# Altium schematic sheet PSU2.SchDoc: PSU2
size A3; Date: JUN 2020; ApprovedBy: Hören; CheckedBy: Mörz; Author: Rudziński; CompanyName: Semi-ATE; DrawnBy: Rudziński; Engineer: Hören; Organization: Semi-ATE; DocumentNumber: 15; SheetNumber: 15; SheetTotal: 20
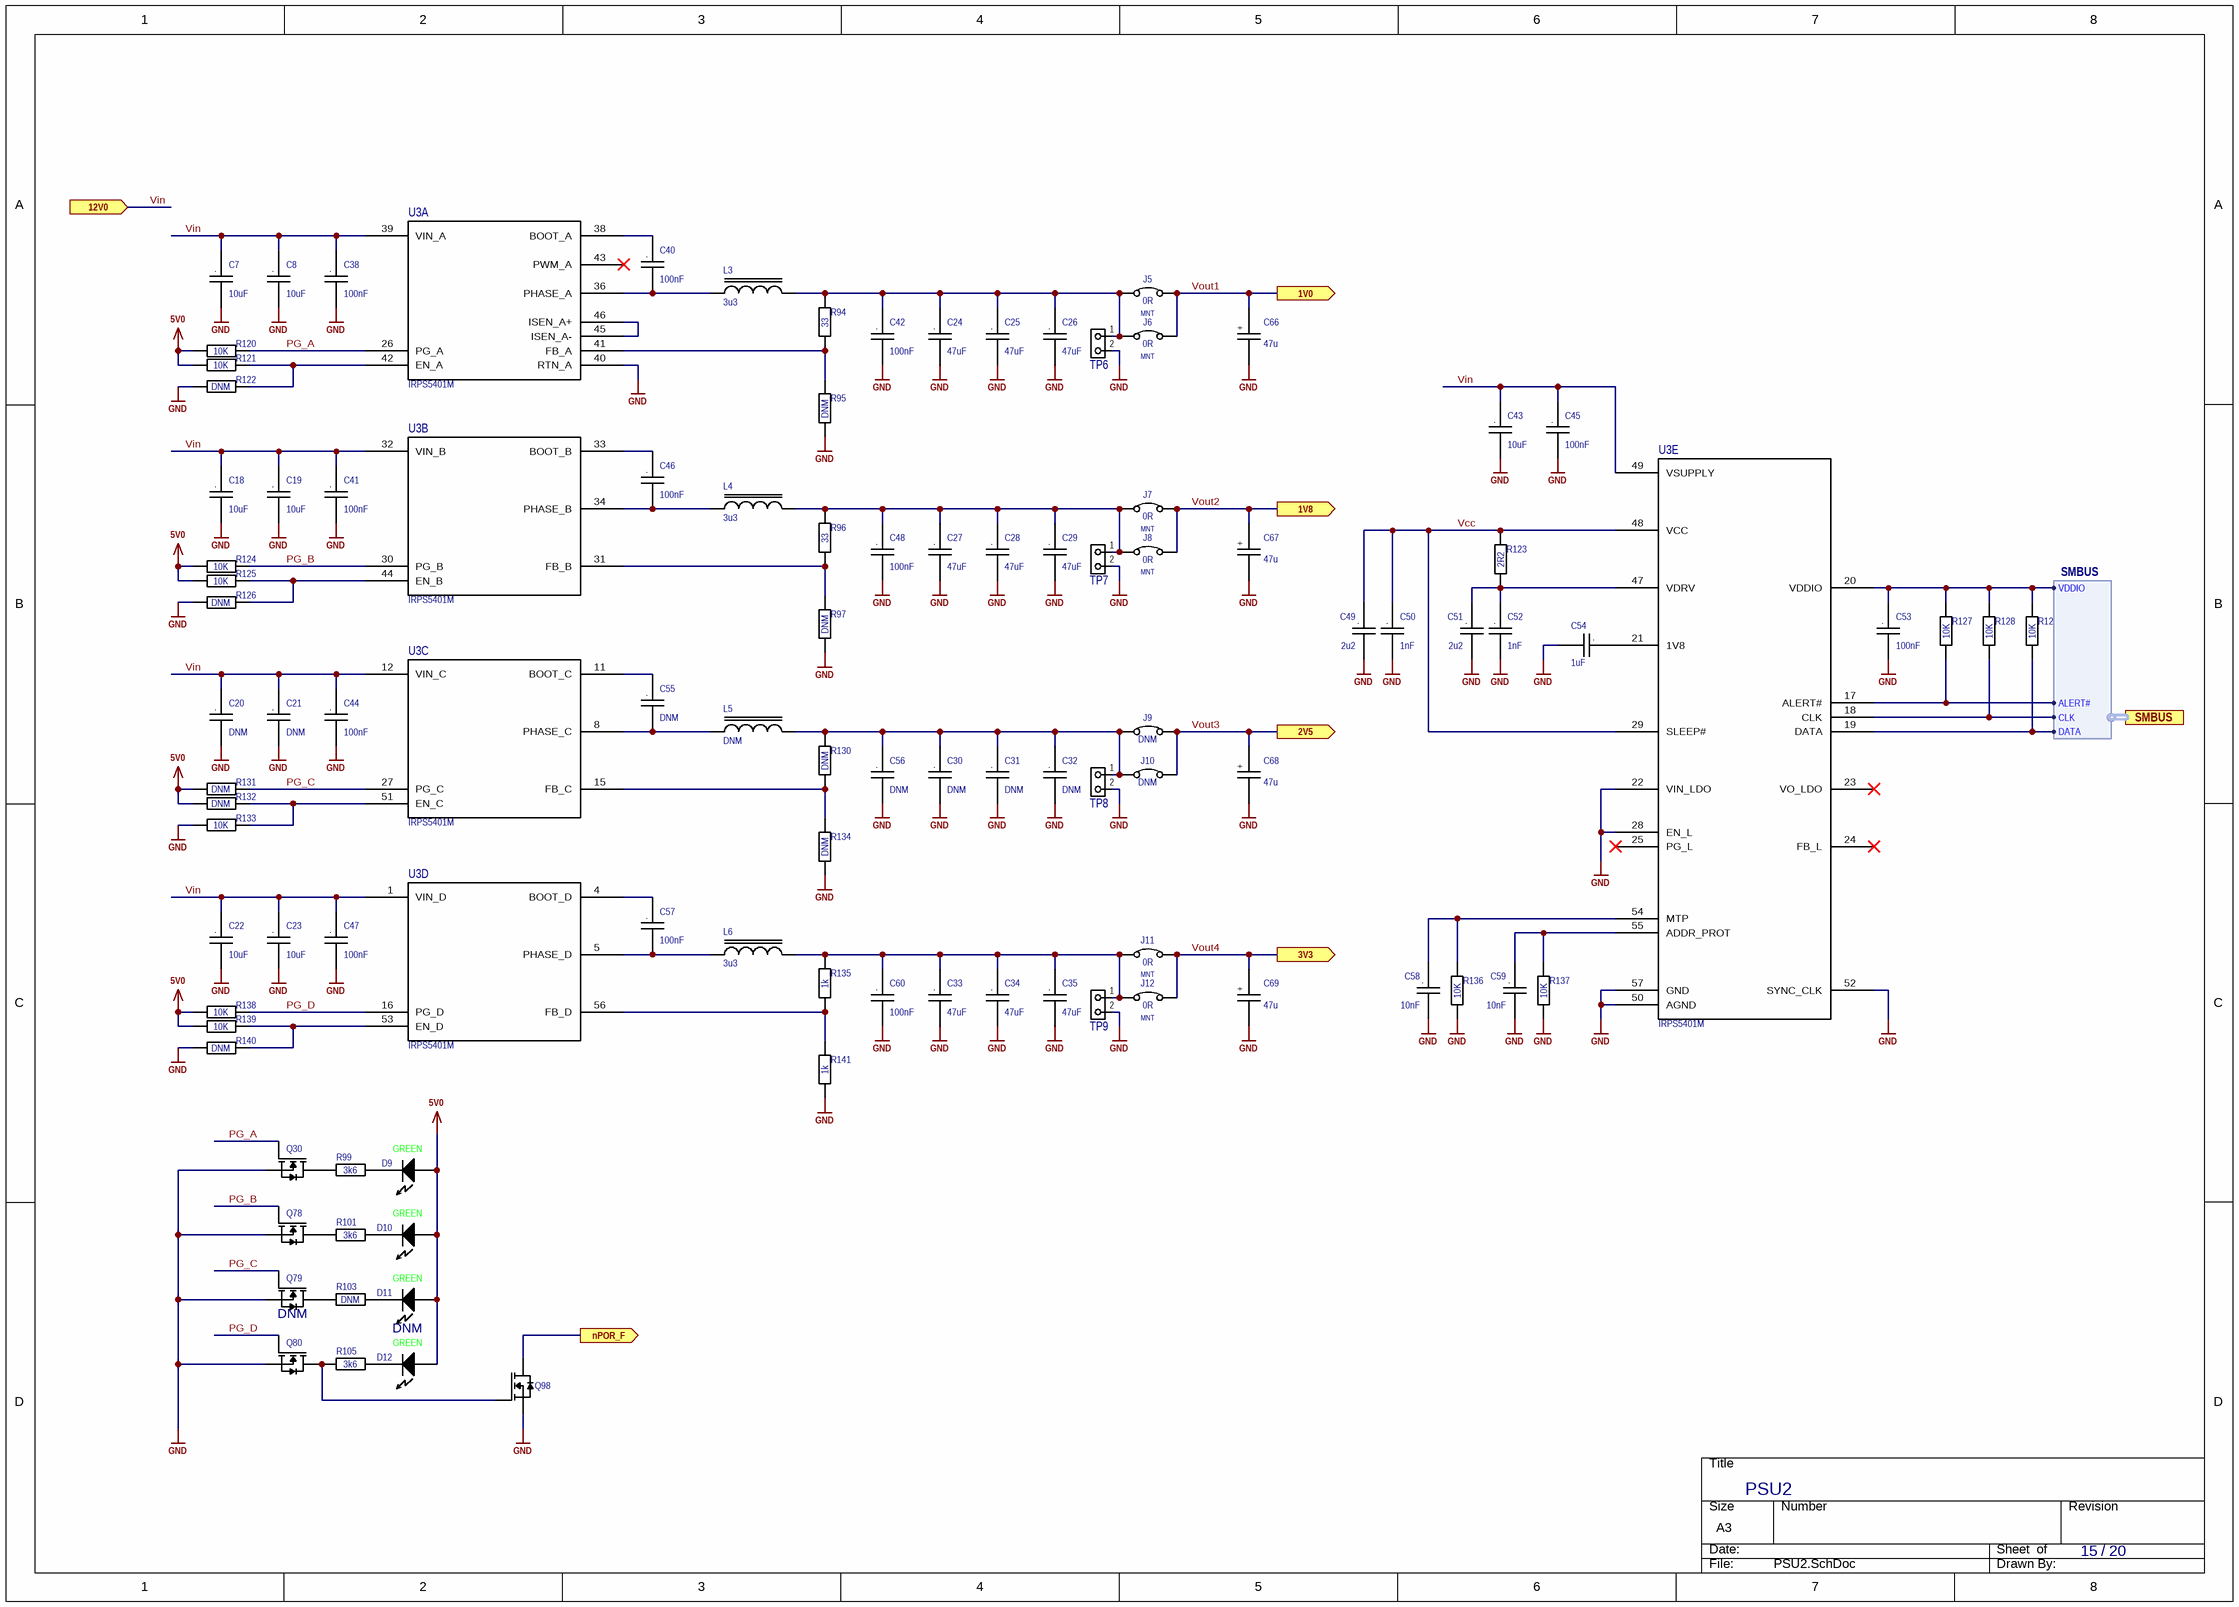
[diagram p0: PSU2.SchDoc]

## Parts
C7  value 10uF  [C1206 Reflow]  (hidden comment: C)
C8  value 10uF  [C1206 Reflow]  (hidden comment: C)
C18  value 10uF  [C1206 Reflow]  (hidden comment: C)
C19  value 10uF  [C1206 Reflow]  (hidden comment: C)
C20  value DNM  [C1206 Reflow]  (hidden comment: C)  (no BOM)
C21  value DNM  [C1206 Reflow]  (hidden comment: C)  (no BOM)
C22  value 10uF  [C1206 Reflow]  (hidden comment: C)
C23  value 10uF  [C1206 Reflow]  (hidden comment: C)
C24  value 47uF  [C1210 Reflow]  (hidden comment: C)
C25  value 47uF  [C1210 Reflow]  (hidden comment: C)
C26  value 47uF  [C1210 Reflow]  (hidden comment: C)
C27  value 47uF  [C1210 Reflow]  (hidden comment: C)
C28  value 47uF  [C1210 Reflow]  (hidden comment: C)
C29  value 47uF  [C1210 Reflow]  (hidden comment: C)
C30  value DNM  [C1210 Reflow]  (hidden comment: C)  (no BOM)
C31  value DNM  [C1210 Reflow]  (hidden comment: C)  (no BOM)
C32  value DNM  [C1210 Reflow]  (hidden comment: C)  (no BOM)
C33  value 47uF  [C1210 Reflow]  (hidden comment: C)
C34  value 47uF  [C1210 Reflow]  (hidden comment: C)
C35  value 47uF  [C1210 Reflow]  (hidden comment: C)
C38  value 100nF  [C0402 Reflow]  (hidden comment: C)
C40  value 100nF  [C0402 Reflow]  (hidden comment: C)
C41  value 100nF  [C0402 Reflow]  (hidden comment: C)
C42  value 100nF  [C0402 Reflow]  (hidden comment: C)
C43  value 10uF  [C1206 Reflow]  (hidden comment: C)
C44  value 100nF  [C0402 Reflow]  (hidden comment: C)
C45  value 100nF  [C0402 Reflow]  (hidden comment: C)
C46  value 100nF  [C0402 Reflow]  (hidden comment: C)
C47  value 100nF  [C0402 Reflow]  (hidden comment: C)
C48  value 100nF  [C0402 Reflow]  (hidden comment: C)
C49  value 2u2  [C0805 Reflow]  (hidden comment: C)
C50  value 1nF  [C0402 Reflow]  (hidden comment: C)
C51  value 2u2  [C0805 Reflow]  (hidden comment: C)
C52  value 1nF  [C0402 Reflow]  (hidden comment: C)
C53  value 100nF  [C0402 Reflow]  (hidden comment: C)
C54  value 1uF  [C0402 Reflow]  (hidden comment: C)
C55  value DNM  [C0402 Reflow]  (hidden comment: C)  (no BOM)
C56  value DNM  [C0402 Reflow]  (hidden comment: C)  (no BOM)
C57  value 100nF  [C0402 Reflow]  (hidden comment: C)
C58  value 10nF  [C0402 Reflow]  (hidden comment: C)
C59  value 10nF  [C0402 Reflow]  (hidden comment: C)
C60  value 100nF  [C0402 Reflow]  (hidden comment: C)
C66  value 47u  [CAP_TAN_B]  (hidden comment: C+)
C67  value 47u  [CAP_TAN_B]  (hidden comment: C+)
C68  value 47u  [CAP_TAN_B]  (hidden comment: C+)
C69  value 47u  [CAP_TAN_B]  (hidden comment: C+)
D9  Color: GREEN  [L0603G]  (hidden comment: D)
D10  Color: GREEN  [L0603G]  (hidden comment: D)
D11  Color: GREEN  NicName: DNM  [L0603G]  (hidden comment: D)  (no BOM)
D12  Color: GREEN  [L0603G]  (hidden comment: D)
J5  value 0R  POPULATED: MNT  [JumperSMD]  (hidden comment: J)  (no BOM)
J6  value 0R  POPULATED: MNT  [JumperSMD]  (hidden comment: J)  (no BOM)
J7  value 0R  POPULATED: MNT  [JumperSMD]  (hidden comment: J)  (no BOM)
J8  value 0R  POPULATED: MNT  [JumperSMD]  (hidden comment: J)  (no BOM)
J9  value DNM  [JumperSMD]  (hidden comment: J)  (no BOM)
J10  value DNM  [JumperSMD]  (hidden comment: J)  (no BOM)
J11  value 0R  POPULATED: MNT  [JumperSMD]  (hidden comment: J)  (no BOM)
J12  value 0R  POPULATED: MNT  [JumperSMD]  (hidden comment: J)  (no BOM)
L3  Inductance: 3u3  [XAL7070]  (hidden comment: L)
L4  Inductance: 3u3  [XAL7070]  (hidden comment: L)
L5  Inductance: DNM  [XAL7070]  (hidden comment: L)  (no BOM)
L6  Inductance: 3u3  [XAL7070]  (hidden comment: L)
Q30  Q  [SOT23-3]  (value not drawn)
Q78  Q  [SOT23-3]  (value not drawn)
Q79  NicName: DNM  [SOT23-3]  (hidden comment: Q)  (no BOM)
Q80  Q  [SOT23-3]  (value not drawn)
Q98  Q  [SOT23-3]  (value not drawn)
R94  value 33  [R0402 Reflow]  (hidden comment: R)
R95  value DNM  [R0402 Reflow]  (hidden comment: R)  (no BOM)
R96  value 33  [R0402 Reflow]  (hidden comment: R)
R97  value DNM  [R0402 Reflow]  (hidden comment: R)  (no BOM)
R99  value 3k6  [R0603 Reflow]  (hidden comment: R)
R101  value 3k6  [R0603 Reflow]  (hidden comment: R)
R103  value DNM  [R0603 Reflow]  (hidden comment: R)  (no BOM)
R105  value 3k6  [R0603 Reflow]  (hidden comment: R)
R120  value 10K  [R0402 Reflow]  (hidden comment: R)
R121  value 10K  [R0402 Reflow]  (hidden comment: R)
R122  value DNM  [R0402 Reflow]  (hidden comment: R)  (no BOM)
R123  value 2R2  [R0402 Reflow]  (hidden comment: R)
R124  value 10K  [R0402 Reflow]  (hidden comment: R)
R125  value 10K  [R0402 Reflow]  (hidden comment: R)
R126  value DNM  [R0402 Reflow]  (hidden comment: R)  (no BOM)
R127  value 10K  [R0402 Reflow]  (hidden comment: R)
R128  value 10K  [R0402 Reflow]  (hidden comment: R)
R129  value 10K  [R0402 Reflow]  (hidden comment: R)
R130  value DNM  [R0402 Reflow]  (hidden comment: R)  (no BOM)
R131  value DNM  [R0402 Reflow]  (hidden comment: R)  (no BOM)
R132  value DNM  [R0402 Reflow]  (hidden comment: R)  (no BOM)
R133  value 10K  [R0402 Reflow]  (hidden comment: R)
R134  value DNM  [R0402 Reflow]  (hidden comment: R)  (no BOM)
R135  value 1k  [R0402 Reflow]  (hidden comment: R)
R136  value 10K  [R0402 Reflow]  (hidden comment: R)
R137  value 10K  [R0402 Reflow]  (hidden comment: R)
R138  value 10K  [R0402 Reflow]  (hidden comment: R)
R139  value 10K  [R0402 Reflow]  (hidden comment: R)
R140  value DNM  [R0402 Reflow]  (hidden comment: R)  (no BOM)
R141  value 1k  [R0402 Reflow]  (hidden comment: R)
TP6  TP  [DualTestpoint 100mils]  (value not drawn)  (no BOM)
TP7  TP  [DualTestpoint 100mils]  (value not drawn)  (no BOM)
TP8  TP  [DualTestpoint 100mils]  (value not drawn)  (no BOM)
TP9  TP  [DualTestpoint 100mils]  (value not drawn)  (no BOM)
U3  U  [QFN4-7x7-56_IRPS5401M]  (value not drawn)  (parts A,B,C,D,E of 5)

## Ports
1V0 (out), 1V8 (out), 2V5 (out), 3V3 (out), 12V0 (in), nPOR_F (out), SMBUS (harness SMBUS)

## Harnesses
SMBUS: ALERT#, CLK, DATA, VDDIO

## Nets
5V0: D9.1(Anode) D10.1(Anode) D11.1(Anode) D12.1(Anode) R120.2 R121.2 R124.2 R125.2 R131.2 R132.2 R138.2 R139.2
GND: C7.2 C8.2 C18.2 C19.2 C20.2 C21.2 C22.2 C23.2 C24.2 C25.2 C26.2 C27.2 C28.2 C29.2 C30.2 C31.2 C32.2 C33.2 C34.2 C35.2 C38.2 C41.2 C42.2 C43.2 C44.2 C45.2 C47.2 C48.2 C49.2 C50.2 C51.2 C52.2 C53.2 C54.2 C56.2 C58.2 C59.2 C60.2 C66.2 C67.2 C68.2 C69.2 Q30.2(S) Q78.2(S) Q79.2(S) Q80.2(S) Q98.2(S) R95.1 R97.1 R122.2 R126.2 R133.2 R134.1 R136.1 R137.1 R140.2 R141.1 TP6.2 TP7.2 TP8.2 TP9.2 U3.22(VIN_LDO) U3.28(EN_L) U3.40(RTN_A) U3.50(AGND) U3.52(SYNC_CLK) U3.57(GND)
nPOR_F: Q98.3(D) ; port nPOR_F
PG_A: Q30.1(G) R120.1 U3.26(PG_A)
PG_B: Q78.1(G) R124.1 U3.30(PG_B)
PG_C: Q79.1(G) R131.1 U3.27(PG_C)
PG_D: Q80.1(G) R138.1 U3.16(PG_D)
Vcc: C49.1 C50.1 R123.2 U3.29(SLEEP#) U3.48(VCC)
Vin: C7.1 C8.1 C18.1 C19.1 C20.1 C21.1 C22.1 C23.1 C38.1 C41.1 C43.1 C44.1 C45.1 C47.1 U3.1(VIN_D) U3.12(VIN_C) U3.32(VIN_B) U3.39(VIN_A) U3.49(VSUPPLY) ; port 12V0
Vout1: C66.1 J5.2 J6.2 ; port 1V0
Vout2: C67.1 J7.2 J8.2 ; port 1V8
Vout3: C68.1 J9.2 J10.2 ; port 2V5
Vout4: C69.1 J11.2 J12.2 ; port 3V3
NetC24_1: C24.1 C25.1 C26.1 C42.1 J5.1 J6.1 L3.2 R94.2 TP6.1
NetC27_1: C27.1 C28.1 C29.1 C48.1 J7.1 J8.1 L4.2 R96.2 TP7.1
NetC30_1: C30.1 C31.1 C32.1 C56.1 J9.1 J10.1 L5.2 R130.2 TP8.1
NetC33_1: C33.1 C34.1 C35.1 C60.1 J11.1 J12.1 L6.2 R135.2 TP9.1
NetC40_1: C40.1 U3.38(BOOT_A)
NetC40_2: C40.2 L3.1 U3.36(PHASE_A)
NetC46_1: C46.1 U3.33(BOOT_B)
NetC46_2: C46.2 L4.1 U3.34(PHASE_B)
NetC51_1: C51.1 C52.1 R123.1 U3.47(VDRV)
NetC53_1: C53.1 R127.2 R128.2 R129.2 U3.20(VDDIO) ; port SMBUS.VDDIO
NetC54_1: C54.1 U3.21(1V8)
NetC55_1: C55.1 U3.11(BOOT_C)
NetC55_2: C55.2 L5.1 U3.8(PHASE_C)
NetC57_1: C57.1 U3.4(BOOT_D)
NetC57_2: C57.2 L6.1 U3.5(PHASE_D)
NetC58_1: C58.1 R136.2 U3.54(MTP)
NetC59_1: C59.1 R137.2 U3.55(ADDR_PROT)
NetD9_2: D9.2(Cathode) R99.2
NetD10_2: D10.2(Cathode) R101.2
NetD11_2: D11.2(Cathode) R103.2
NetD12_2: D12.2(Cathode) R105.2
NetQ30_3: Q30.3(D) R99.1
NetQ78_3: Q78.3(D) R101.1
NetQ79_3: Q79.3(D) R103.1
NetQ80_3: Q80.3(D) Q98.1(G) R105.1
NetR94_1: R94.1 R95.2 U3.41(FB_A)
NetR96_1: R96.1 R97.2 U3.31(FB_B)
NetR121_1: R121.1 R122.1 U3.42(EN_A)
NetR125_1: R125.1 R126.1 U3.44(EN_B)
NetR127_1: R127.1 U3.17(ALERT#) ; port SMBUS.ALERT#
NetR128_1: R128.1 U3.18(CLK) ; port SMBUS.CLK
NetR129_1: R129.1 U3.19(DATA) ; port SMBUS.DATA
NetR130_1: R130.1 R134.2 U3.15(FB_C)
NetR132_1: R132.1 R133.1 U3.51(EN_C)
NetR135_1: R135.1 R141.2 U3.56(FB_D)
NetR139_1: R139.1 R140.1 U3.53(EN_D)
NetU3_45: U3.45(ISEN_A-) U3.46(ISEN_A+)

Not connected (* = marked no-connect by the designer): U3 23(VO_LDO)* 24(FB_L)* 25(PG_L)* 43(PWM_A)*

## Notes on the sheet
- /
- designed by
- reviewed by
- last drawn by
- Project:
- Schematic:
- last printed
- DIN-A3 L
- sheets
- of
- File:
- (in symbol C) .
- (in symbol C+_TAN) +
- (in symbol C_2) .
- (in symbol C_7) .
- (in symbol C_10) .
- (in symbol C_11) .

## Library data of the parts
C7 C8 C18-C23 C43 = C: CAP CER 10UF 25V X7R 1206; 04. Manufacturer: TDK Corporation; 07. Manufacturer  Part Number: C3216X7R1E106K160AB; Tolerance: ±10%; 03. Unit Price: 0.66; 13. Created Date/Name: AUG2018/Hören; Voltage Rating: 25V; Type: X7R; ComponentLink1Description: Info; ComponentLink1URL: https://www.digikey.de/products/en?keywords=445-7705-6-ND; 02. Distributor Part Number: 445-7705-6-ND; 09. Operating Temperature: -55°C ~ 125°C; 11. RoHS: YES; 01. Distributor: DigiKey; ComponentLink2Description: DataSheet; Package: 1206
C24-C35 = C: CAP CER 47UF 10V X5R 1210; 04. Manufacturer: Samsung Electro-Mechanics; 07. Manufacturer  Part Number: CL32A476MPJNNNE; Tolerance: ±20%; 03. Unit Price: 0.88; 13. Created Date/Name: AUG2018/Hören; Voltage Rating: 10V; Type: X5R; ComponentLink1Description: Info; ComponentLink1URL: *; 02. Distributor Part Number: 1276-3380-6-ND; 09. Operating Temperature: -55°C ~ 85°C; 11. RoHS: YES; 01. Distributor: DigiKey; ComponentLink2Description: DataSheet; Package: 1210
C38 C40-C42 C44-C48 C53 C55-C57 C60 = C: CAP CER 0.1UF 25V X7R 0402; 04. Manufacturer: Yageo; 07. Manufacturer  Part Number: CC0402KRX7R8BB104; Tolerance: ±10%; 03. Unit Price: 0.09; 13. Created Date/Name: AUG2018/Hören; Voltage Rating: 25V; Type: X7R; ComponentLink1Description: Info; ComponentLink1URL: https://www.digikey.de/products/en?keywords=311-2077-6-ND; 02. Distributor Part Number: 311-2077-6-ND; 09. Operating Temperature: -55°C ~ 125°C; 11. RoHS: YES; 01. Distributor: DigiKey; ComponentLink2Description: DataSheet; Package: 0402
C49 C51 = C_11: CAP CER 2.2UF 10V X7R 0805; 04. Manufacturer: Samsung Electro-Mechanics; 07. Manufacturer  Part Number: CL21B225KPFNNNE; 03. Unit Price: 0.11; Voltage Rating: 10V; Type: X7R; ComponentLink1Description: Info; ComponentLink1URL: https://www.digikey.de/products/en?keywords=311-2077-6-ND; 02. Distributor Part Number: 1276-1188-1-ND; 11. RoHS: YES; 01. Distributor: DigiKey; ComponentLink2Description: DataSheet; Package: 0805
C50 C52 = C_7: CAP CER 1000PF 25V X7R 0402; 04. Manufacturer: KEMET; 07. Manufacturer  Part Number: C0402C102K3RACTU; Tolerance: ±10%; 03. Unit Price: 0.09; 13. Created Date/Name: AUG2018/Hören; Voltage Rating: 25V; Type: X7R; ComponentLink1Description: Info; ComponentLink1URL: https://www.digikey.de/products/en?keywords=399-1031-6-ND; 02. Distributor Part Number: 399-1031-6-ND; 09. Operating Temperature: -55°C ~ 125°C; 11. RoHS: YES; 01. Distributor: DigiKey; ComponentLink2Description: DataSheet; Package: 0402
C54 = C_2: CAP CER 1UF 6.3V X7R 0402; 04. Manufacturer: Murata Electronics; 07. Manufacturer  Part Number: GRM155R70J105KA12J; Tolerance: ±10%; 03. Unit Price: 0.11; 13. Created Date/Name: AUG2018/Hören; Voltage Rating: 6.3V; Type: X7R; ComponentLink1Description: Info; ComponentLink1URL: https://www.digikey.de/product-detail/en/murata-electronics/GRM155R70J105KA12J/490-13339-6-ND/5973468; 02. Distributor Part Number: 490-13339-6-ND; 09. Operating Temperature: -55°C ~ 125°C; 11. RoHS: YES; 01. Distributor: DigiKey; ComponentLink2Description: DataSheet; Package: 0402
C58 C59 = C_10: CAP CER 0.01UF 25V X7R 0402; 04. Manufacturer: Murata Electronics; 07. Manufacturer  Part Number: GCM155R71E103KA37D; Tolerance: ±10%; 03. Unit Price: 0.09; Voltage Rating: 25V; Type: X7R; ComponentLink1Description: Info; 02. Distributor Part Number: 490-6043-1-ND; 09. Operating Temperature: -55°C ~ 125°C; 11. RoHS: YES; 01. Distributor: DigiKey; ComponentLink2Description: DataSheet; ComponentLink2URL: https://www.murata.com/~/media/webrenewal/support/library/catalog/products/capacitor/mlcc/c03e.ashx?la=en-us; Package: 0402
  C58: ComponentLink1URL: https://www.digikey.de/products/en?keywords=311-2077-6-ND
  C59: ComponentLink1URL: https://www.digikey.de/product-detail/en/murata-electronics/GCM155R71E103KA37D/490-6043-1-ND/3845243
C66-C69 = C+_TAN: CAP TANT 47UF 20% 10V 1411; 04. Manufacturer: AVX Corporation; 07. Manufacturer  Part Number: F971A476MBAHT3; 03. Unit Price: 0.73; 3D-Export: No; ComponentLink1Description: Info; 02. Distributor Part Number: 478-12531-1-ND; 11. RoHS: YES; 01. Distributor: DigiKey; ComponentLink2Description: DataSheet
D9-D12 = LED: LED GREEN DIFFUSED 0603 SMD; 04. Manufacturer: OSRAM Opto Semiconductors Inc.; 07. Manufacturer  Part Number: LG L29K-G2J1-24-Z; Vf: 1.7V; If: 2mA; Wave Length: 570nm; Viewing Angle: 160°; 03. Unit Price: 0.4; 13. Created Date/Name: AUG2018/Hören; ComponentLink1Description: Info; ComponentLink1URL: https://www.digikey.de/products/en?keywords=475-2709-6-ND; ComponentLink2Description: DataSheet; ComponentLink2URL: https://www.digikey.de/products/en?keywords=475-2709-6-ND; 02. Distributor Part Number: 475-2709-6-ND; 11. RoHS: YES; 01. Distributor: DigiKey
J5-J12 = Jumper SMD: RES SMD 0 OHM JUMPER 1/10W 0603; 04. Manufacturer: Yageo; 07. Manufacturer  Part Number: RC0603JR-070RL; 03. Unit Price: 0.09; 01. Distributor: DigiKey; 02. Distributor Part Number: 311-0.0GRDKR-ND; 09. Operating Temperature: -55°C ~ 155°C; 11. RoHS: YES; Package: 0603; ComponentLink4Description: Info; ComponentLink4URL: https://www.digikey.de/product-detail/en/yageo/RC0603JR-070RL/311-0.0GRDKR-ND/732569; ComponentLink5Description: DataSheet; ComponentLink5URL: http://www.yageo.com/documents/recent/PYu-RC_Group_51_RoHS_L_10.pdf
L3-L6 = INDUCTOR: Fixed Inductors 3.3uH Shld 20% 15.1A 9.42mOhms AECQ2; 04. Manufacturer: Coilcraft; 07. Manufacturer  Part Number: XAL7070-332MEC; Impedance Tolerance: %; 03. Unit Price: 3.05; ComponentLink1Description: Info; ComponentLink1URL: https://www.digikey.de/products/en?keywords=732-1620-6-ND; ComponentLink2Description: DataSheet; ComponentLink2URL: https://www.we-online.de/katalog/datasheet/742792040.pdf; 02. Distributor Part Number: 994-XAL7070-332MEC; 11. RoHS: YES; Tolerance: *; Value: *; 01. Distributor: Mouser
Q30 Q78-Q80 Q98 = FDV303N: MOSFET N-CH 25V 680MA SOT-23; 04. Manufacturer: ON Semiconductor; 03. Unit Price: 0.41; 13. Created Date/Name: AUG 2018 / Hören; Rds On: 450 mΩ @ id=500mA & Vgs=4.5V; Vgs,th: 1.5V @ 250uA; Power Rating: 350mW; 3D-Export: No; 01. Distributor: DigiKey; 02. Distributor Part Number: FDV303NDKR-ND; 07. Manufacturer  Part Number: FDV303N; 09. Operating Temperature: -55°C ~ 150°C (TJ); 11. RoHS: YES; ComponentLink1Description: Info; ComponentLink1URL: https://www.digikey.de/product-detail/en/on-semiconductor/FDV303N/FDV303NDKR-ND/1630434; ComponentLink2Description: DataSheet; ComponentLink2URL: https://media.digikey.com/pdf/Data%20Sheets/Fairchild%20PDFs/FDV303N.pdf; Vdss: 25V; Id: 680mA
R94 R96 = R: RES SMD 33 OHM 1% 1/16W 0402; 04. Manufacturer: Yageo; 07. Manufacturer  Part Number: RC0402FR-0733RL; 03. Unit Price: 0.09; 13. Created Date/Name: AUG2018/Hören; Power Rating: 63mW; Tolerance: ±1%; ComponentLink1URL: https://www.digikey.de/products/en?keywords=311-10.0KLRDKR-ND; ComponentLink1Description: Info; 02. Distributor Part Number: 311-33.0LRDKR-ND; 09. Operating Temperature: -55°C ~ 155°C; 11. RoHS: YES; 01. Distributor: DigiKey; ComponentLink2Description: DataSheet; Type: Thick Film; Package: 0402
R95 R97 R120-R122 R124-R134 R136-R140 = R: RES SMD 10K OHM 1% 1/16W 0402; 04. Manufacturer: Yageo; 07. Manufacturer  Part Number: RC0402FR-0710KL; 03. Unit Price: 0.09; 13. Created Date/Name: AUG2018/Hören; Power Rating: 63mW; Tolerance: ±1%; ComponentLink1URL: https://www.digikey.de/products/en?keywords=311-10.0KLRDKR-ND; ComponentLink1Description: Info; 02. Distributor Part Number: 311-10.0KLRDKR-ND; 09. Operating Temperature: -55°C ~ 155°C; 11. RoHS: YES; 01. Distributor: DigiKey; ComponentLink2Description: DataSheet; Type: Thick Film; Package: 0402
R99 R101 R105 = R: RES SMD 3.6K OHM 1% 1/10W 0603; 04. Manufacturer: Yageo; 07. Manufacturer  Part Number: RC0603FR-073K6L; 03. Unit Price: 0.09; 13. Created Date/Name: AUG2018/Hören; Power Rating: 63mW; Tolerance: ±1%; ComponentLink1URL: https://www.digikey.de/product-detail/en/yageo/RC0402FR-071K65L/YAG3043DKR-ND/5282914; ComponentLink1Description: Info; 02. Distributor Part Number: 311-3.60KHRCT-ND; 09. Operating Temperature: -55°C ~ 155°C; 11. RoHS: YES; 01. Distributor: DigiKey; ComponentLink2Description: DataSheet; Type: Thick Film; Package: 0402
R103 = R: RES SMD 1.65K OHM 1% 1/16W 0402; 04. Manufacturer: Yageo; 07. Manufacturer  Part Number: RC0402FR-071K65L; 03. Unit Price: 0.09; 13. Created Date/Name: AUG2018/Hören; Power Rating: 63mW; Tolerance: ±1%; ComponentLink1URL: https://www.digikey.de/product-detail/en/yageo/RC0402FR-071K65L/YAG3043DKR-ND/5282914; ComponentLink1Description: Info; 02. Distributor Part Number: YAG3043DKR-ND; 09. Operating Temperature: -55°C ~ 155°C; 11. RoHS: YES; 01. Distributor: DigiKey; ComponentLink2Description: DataSheet; Type: Thick Film; Package: 0402
R123 = R_24: RES SMD 2.2 OHM 1% 1/16W 0402; 04. Manufacturer: Yageo; 07. Manufacturer  Part Number: RC0402FR-072R2L; 03. Unit Price: 0.09; Power Rating: 0.1W; Tolerance: ±1%; ComponentLink1URL: https://www.digikey.de/product-detail/en/panasonic-electronic-components/ERJ-2RKF15R0X/P15.0LDKR-ND/575530; ComponentLink1Description: Info; 02. Distributor Part Number: 311-2.20LRTR-ND; 11. RoHS: YES; 01. Distributor: DigiKey; ComponentLink2Description: DataSheet; ComponentLink2URL: https://industrial.panasonic.com/cdbs/www-data/pdf/RDA0000/AOA0000C304.pdf; Package: 0402
R135 R141 = R: RES SMD 1K OHM 1% 1/16W 0402; 04. Manufacturer: Yageo; 07. Manufacturer  Part Number: RC0402FR-071KP; 03. Unit Price: 0.09; 13. Created Date/Name: AUG2018/Hören; Power Rating: 63mW; Tolerance: ±1%; ComponentLink1URL: https://www.digikey.de/products/en?keywords=311-10.0KLRDKR-ND; ComponentLink1Description: Info; 02. Distributor Part Number: YAG1254CT-ND; 09. Operating Temperature: -55°C ~ 155°C; 11. RoHS: YES; 01. Distributor: DigiKey; ComponentLink2Description: DataSheet; Type: Thick Film; Package: 0402
TP6-TP9 = DualTestpoint 100mils: Dual testpoint, pitch 2.54mm; 04. Manufacturer: Samtec Inc.; 07. Manufacturer  Part Number: HMTSW-103-07-G-S-240; 03. Unit Price: 0.25; 13. Created Date/Name: AUG2018/Hören; 01. Distributor: Samtec Inc.; 02. Distributor Part Number: HMTSW-103-07-G-S-240; 11. RoHS: YES; ComponentLink1Description: Info; ComponentLink1URL: https://www.samtec.com/products/hmtsw-103-07-g-s-240; ComponentLink2Description: DataSheet; ComponentLink2URL: http://suddendocs.samtec.com/catalog_english/hmtsw.pdf
U3 = IRPS5401M: POL - SUPIRBUCK; MFR-PN: IRPS5401MTRPBF; MFR: Infineon; 04. Manufacturer: Infineon Technologies; 03. Unit Price: 6.99; 07. Manufacturer  Part Number: IRPS5401MTRPBF; 01. Distributor: DigiKey; 02. Distributor Part Number: IRPS5401MTRPBFCT-ND; 11. RoHS: YES; ComponentLink4Description: Info; ComponentLink4URL: https://www.digikey.de/products/en?keywords=XC7A15T-1CSG324C; ComponentLink5Description: DataSheet; ComponentLink5URL: https://www.xilinx.com/support/documentation/data_sheets/ds181_Artix_7_Data_Sheet.pdf; ComponentLink6Description: NXP; ComponentLink6URL: https://www.nxp.com/part/MK20DN512VMD10; NicName: IRPS5401M